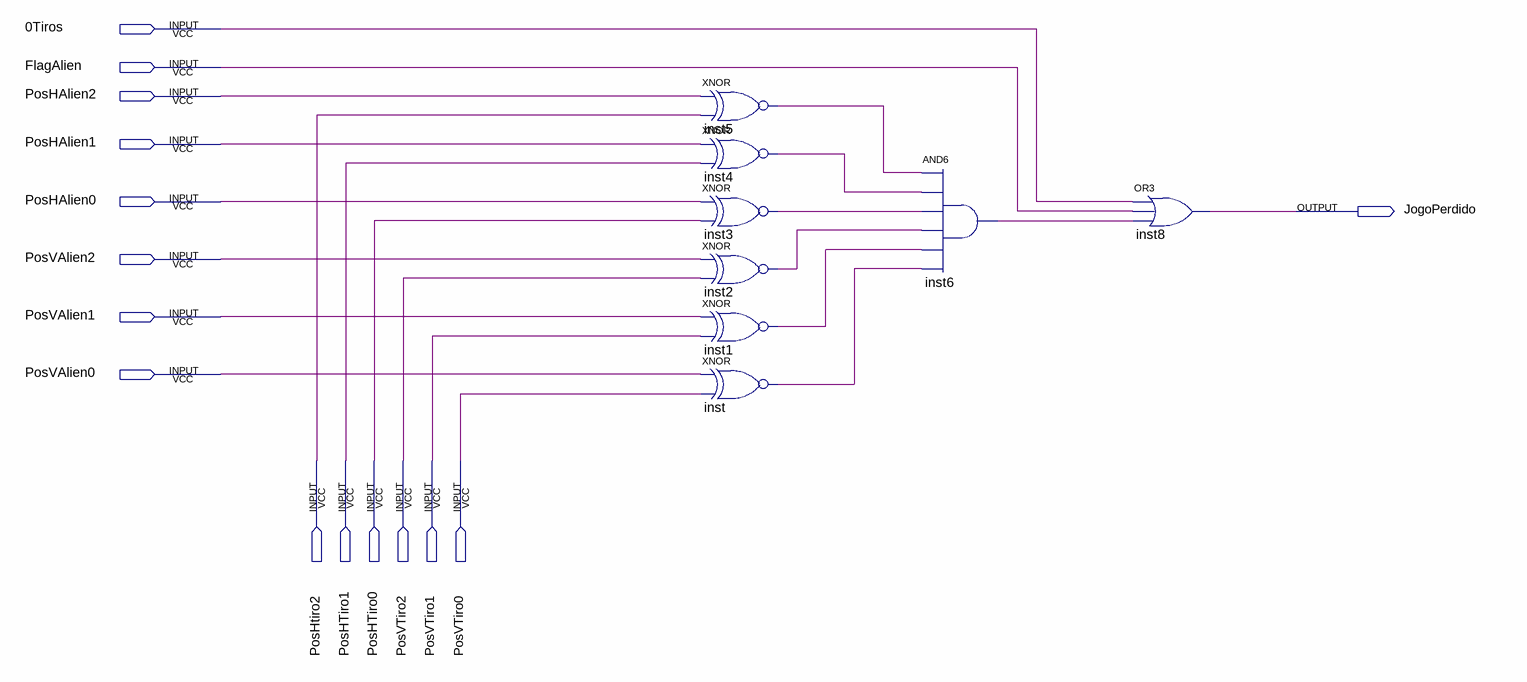
[diagram p0: schematic sheet]
// Quartus schematic JogoPerdido.bdf as structural Verilog: 8 symbols, 15 pins
module JogoPerdido (
  input  \0Tiros ,
  input  FlagAlien,
  input  PosHAlien2,
  input  PosHAlien1,
  input  PosHAlien0,
  input  PosVAlien2,
  input  PosVAlien1,
  input  PosVAlien0,
  input  PosHtiro2,
  input  PosHTiro1,
  input  PosHTiro0,
  input  PosVTiro2,
  input  PosVTiro1,
  input  PosVTiro0,
  output JogoPerdido
);

  wire inst1_out, inst2_out, inst3_out, inst4_out, inst5_out, inst6_out, inst_out;

  xnor inst5 (inst5_out, PosHAlien2, PosHtiro2);
  xnor inst4 (inst4_out, PosHAlien1, PosHTiro1);
  xnor inst3 (inst3_out, PosHAlien0, PosHTiro0);
  xnor inst2 (inst2_out, PosVAlien2, PosVTiro2);
  xnor inst1 (inst1_out, PosVAlien1, PosVTiro1);
  xnor inst (inst_out, PosVAlien0, PosVTiro0);
  and inst6 (inst6_out, inst5_out, inst4_out, inst3_out, inst2_out, inst1_out, inst_out);
  or inst8 (JogoPerdido, \0Tiros , FlagAlien, inst6_out);
endmodule
